# Altium schematic sheet pca10143_sheet2_nrf5340_mcu.SchDoc: PCA10143 - nRF5340 MCU
size A3; Organization: Nordic Semiconductor; DocumentNumber: 2; Revision: 0.7.2; SheetNumber: 2; SheetTotal: 7; CompanyName: Nordic Semiconductor
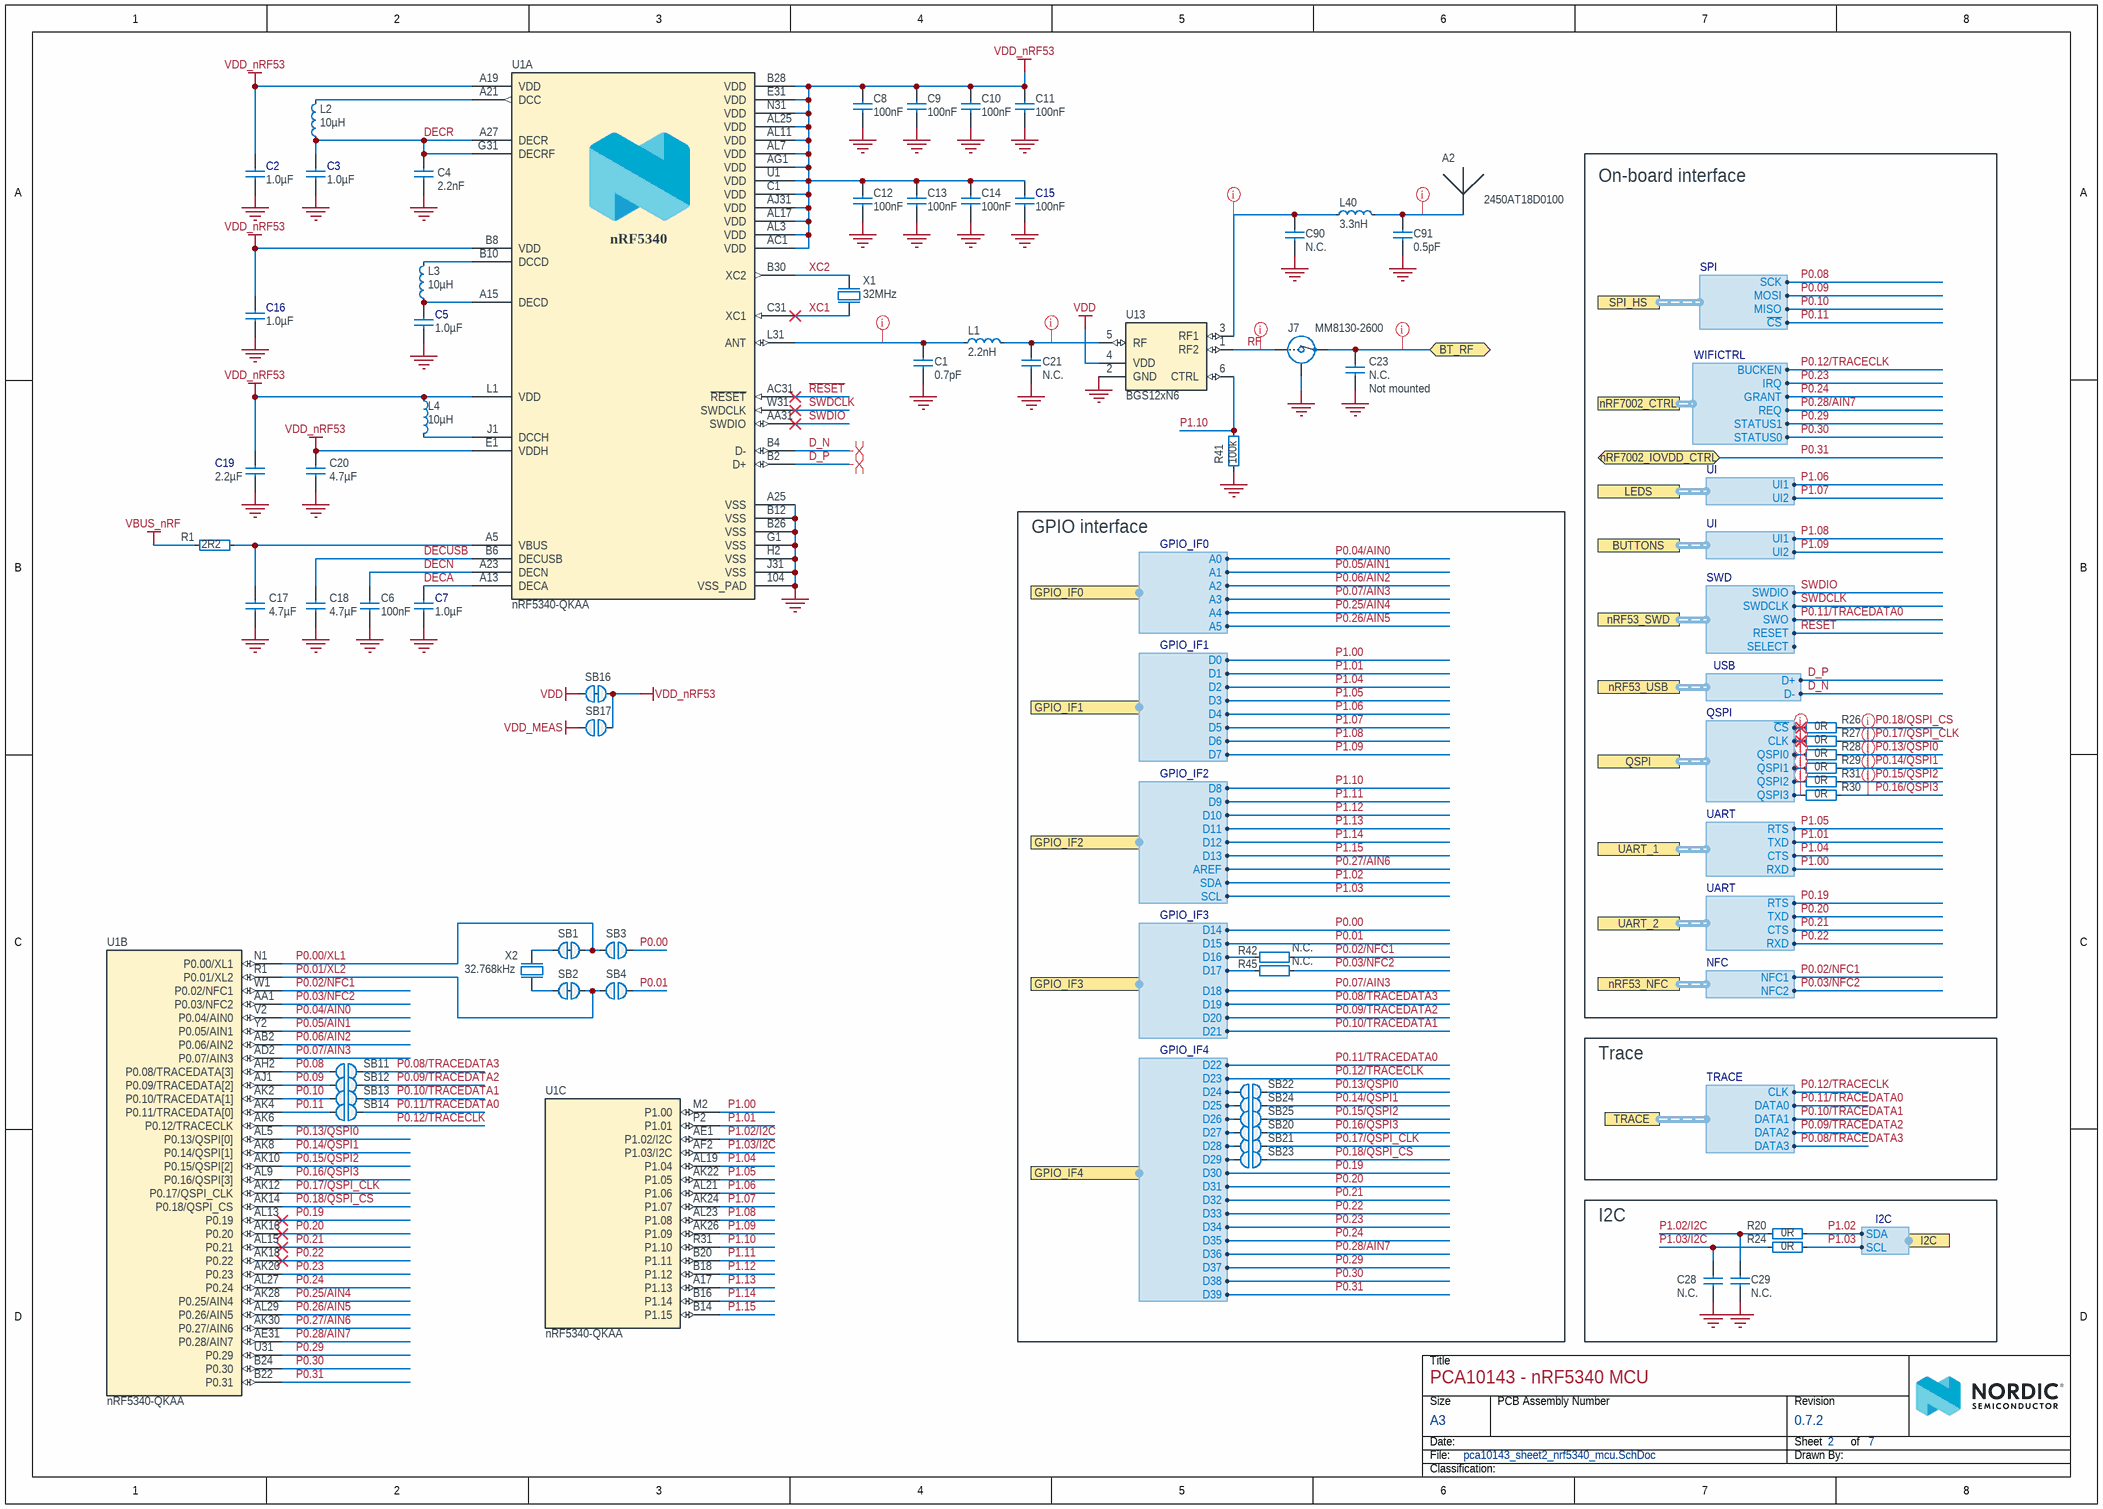
[diagram p0: pca10143_sheet2_nrf5340_mcu.SchDoc]

## Parts
A2  2450AT18D0100  [2450AT18D0100_STD-R]
C1  0.7pF  [CAPC0603X03L_C]
C2  1.0µF  [CAPC1005X04L]
C3  1.0µF  [CAPC1005X04L]
C4  2.2nF  [CAPC0603X03L_C]
C5  1.0µF  [CAPC1005X04L]
C6  100nF  [CAPC0603X03L_C]
C7  1.0µF  [CAPC1005X04L]
C8  100nF  [CAPC0603X03L_C]
C9  100nF  [CAPC0603X03L_C]
C10  100nF  [CAPC0603X03L_C]
C11  100nF  [CAPC0603X03L_C]
C12  100nF  [CAPC0603X03L_C]
C13  100nF  [CAPC0603X03L_C]
C14  100nF  [CAPC0603X03L_C]
C15  100nF  [CAPC0603X03L_C]
C16  1.0µF  [CAPC1005X04L]
C17  4.7µF  [CAPC1608X06L]
C18  4.7µF  [CAPC1608X06L]
C19  2.2µF  [CAPC1608X06L]
C20  4.7µF  [CAPC1608X06L]
C21  N.C.  [CAPC0603X03L_C_NC]
C23  N.C.  Assembly: Not mounted  [CAPC0603X03L_C_NC]
C28  N.C.  [CAPC0603X03L_C_NC]
C29  N.C.  [CAPC0603X03L_C_NC]
C90  N.C.  [CAPC0603X03L_C_NC]
C91  0.5pF  [CAPC0603X03L_C]
J7  MM8130-2600  [COAXIAL-SWF]
L1  2.2nH  [INDC0603X03L_C]
L2  10µH  [INDC1608X06L]
L3  10µH  [INDC1608X06L]
L4  10µH  [INDC1608X06L]
L40  3.3nH  [INDC0603X03L_C]
R1  2R2  [RESC0603X03L_C]
R20  0R  [RESC0603X03L_C]
R24  0R  [RESC0603X03L_C]
R26  0R  [RESC0603X03L_C]
R27  0R  [RESC0603X03L_C]
R28  0R  [RESC0603X03L_C]
R29  0R  [RESC0603X03L_C]
R30  0R  [RESC0603X03L_C]
R31  0R  [RESC0603X03L_C]
R41  100k  [RESC0603X03L_C]
R42  N.C.  [RESC0603X03L_C_NC]
R45  N.C.  [RESC0603X03L_C_NC]
SB1  Solderbridge  [Solderbridge_Shorted]  (value not drawn)  (net tie, no BOM)
SB2  Solderbridge  [Solderbridge_Shorted]  (value not drawn)  (net tie, no BOM)
SB3  Solderbridge  [Solderbridge]  (value not drawn)  (no BOM)
SB4  Solderbridge  [Solderbridge]  (value not drawn)  (no BOM)
SB11  Solderbridge  [Solderbridge]  (value not drawn)  (no BOM)
SB12  Solderbridge  [Solderbridge]  (value not drawn)  (no BOM)
SB13  Solderbridge  [Solderbridge]  (value not drawn)  (no BOM)
SB14  Solderbridge  [Solderbridge]  (value not drawn)  (no BOM)
SB16  Solderbridge  [Solderbridge_Shorted]  (value not drawn)  (net tie, no BOM)
SB17  Solderbridge  [Solderbridge]  (value not drawn)  (no BOM)
SB20  Solderbridge  [Solderbridge]  (value not drawn)  (no BOM)
SB21  Solderbridge  [Solderbridge]  (value not drawn)  (no BOM)
SB22  Solderbridge  [Solderbridge]  (value not drawn)  (no BOM)
SB23  Solderbridge  [Solderbridge]  (value not drawn)  (no BOM)
SB24  Solderbridge  [Solderbridge]  (value not drawn)  (no BOM)
SB25  Solderbridge  [Solderbridge]  (value not drawn)  (no BOM)
U1  nRF5340-QKAA  [AQFN40P700X700X85_HS-99N]  (parts A,B,C of 3)
U13  BGS12xN6  [TSNP-6-8]
X1  32MHz  [BT-XTAL_2016]
X2  32.768kHz  [XTAL_2012]

## Blocks framed on the sheet
On-board interface: R26-R31
GPIO interface: R42 R45 SB20-SB25
I2C: C28 C29 R20 R24

## Ports
BT_RF (bidir), BUTTONS (harness UI), GPIO_IF0 (harness GPIO_IF0), GPIO_IF1 (harness GPIO_IF1), GPIO_IF2 (harness GPIO_IF2), GPIO_IF3 (harness GPIO_IF3), GPIO_IF4 (harness GPIO_IF4), I2C (harness I2C), LEDS (harness UI), nRF53_NFC (harness NFC), nRF53_SWD (harness SWD), nRF53_USB (harness USB), nRF7002_CTRL (harness WIFICTRL), nRF7002_IOVDD_CTRL (bidir), QSPI (harness QSPI), SPI_HS (harness SPI), TRACE (harness TRACE), UART_1 (harness UART), UART_2 (harness UART)

## Harnesses
QSPI: ~{CS}, QSPI0, CLK, QSPI1, QSPI2, QSPI3
SWD: SWDIO, SWDCLK, SWO, RESET, SELECT
UI: UI2, UI1
USB: D+, D-
TRACE: CLK, DATA0, DATA1, DATA3, DATA2
NFC: NFC2, NFC1
UART: RTS, CTS, RXD, TXD
GPIO_IF1: D0, D1, D2, D3, D4, D5, D6, D7
GPIO_IF2: D8, D9, D10, D11, D12, D13, AREF, SDA, SCL
GPIO_IF0: A0, A1, A2, A3, A4, A5
GPIO_IF3: D14, D15, D16, D17, D18, D19, D20, D21
I2C: SCL, SDA
GPIO_IF4: D22, D23, D24, D25, D26, D27, D28, D29, D30, D31, D32, D33, D34, D35, D36, D37, D38, D39
WIFICTRL: BUCKEN, GRANT, IRQ, REQ, STATUS0, STATUS1
SPI: ~{CS}, MOSI, MISO, SCK

## Nets
GND: A2.2(GND) C1.1 C2.2 C3.1 C4.2 C5.1 C6.2 C7.1 C8.2 C9.2 C10.2 C11.2 C12.2 C13.2 C14.2 C15.2 C16.1 C17.2 C18.2 C19.2 C20.2 C21.1 C23.2 C28.1 C29.1 C90.1 C91.1 J7.2(Shield) R41.2 U1.104(VSS_PAD) U1.A25(VSS) U1.B12(VSS) U1.B26(VSS) U1.G1(VSS) U1.H2(VSS) U1.J31(VSS) U13.2(GND) X1.2(GND) X1.4(GND)
VBUS_nRF: R1.1
VDD: SB16.1 U13.4(VDD)
VDD_MEAS: SB17.1
VDD_nRF53: C2.1 C8.1 C9.1 C10.1 C11.1 C12.1 C13.1 C14.1 C15.1 C16.2 C19.1 C20.1 L4.1 SB16.2 SB17.2 U1.A19(VDD) U1.AC1(VDD) U1.AG1(VDD) U1.AJ31(VDD) U1.AL3(VDD) U1.AL7(VDD) U1.AL11(VDD) U1.AL17(VDD) U1.AL25(VDD) U1.B8(VDD) U1.B28(VDD) U1.C1(VDD) U1.E1(VDDH) U1.E31(VDD) U1.L1(VDD) U1.N31(VDD) U1.U1(VDD)
BT_RF: C23.1 J7.3(OUT) ; port BT_RF
D_N: U1.B4(D-) ; port nRF53_USB.D-
D_P: U1.B2(D+) ; port nRF53_USB.D+
DECA: C7.2 U1.A13(DECA)
DECN: C6.1 U1.A23(DECN)
DECR: C3.2 C4.1 L2.1 U1.A27(DECR) U1.G31(DECRF)
DECUSB: C18.1 U1.B6(DECUSB)
P0.00: SB3.2 ; port GPIO_IF3.D14
P0.00/XL1: SB1.2 SB3.1 U1.N1(P0.00/XL1)
P0.01: SB4.2 ; port GPIO_IF3.D15
P0.01/XL2: SB2.2 SB4.1 U1.R1(P0.01/XL2)
P0.02/NFC1: R42.2 U1.W1(P0.02/NFC1) ; port nRF53_NFC.NFC1
P0.03/NFC2: R45.2 U1.AA1(P0.03/NFC2) ; port nRF53_NFC.NFC2
P0.04/AIN0: U1.V2(P0.04/AIN0) ; port GPIO_IF0.A0
P0.05/AIN1: U1.Y2(P0.05/AIN1) ; port GPIO_IF0.A1
P0.06/AIN2: U1.AB2(P0.06/AIN2) ; port GPIO_IF0.A2
P0.07/AIN3: U1.AD2(P0.07/AIN3) ; port GPIO_IF0.A3, port GPIO_IF3.D18
P0.08: SB11.2 U1.AH2(P0.08/TRACEDATA[3]) ; port SPI_HS.SCK
P0.08/TRACEDATA3: SB11.1 ; port TRACE.DATA3, port GPIO_IF3.D19
P0.09: SB12.2 U1.AJ1(P0.09/TRACEDATA[2]) ; port SPI_HS.MOSI
P0.09/TRACEDATA2: SB12.1 ; port TRACE.DATA2, port GPIO_IF3.D20
P0.10: SB13.2 U1.AK2(P0.10/TRACEDATA[1]) ; port SPI_HS.MISO
P0.10/TRACEDATA1: SB13.1 ; port TRACE.DATA1, port GPIO_IF3.D21
P0.11: SB14.2 U1.AK4(P0.11/TRACEDATA[0]) ; port SPI_HS.~{CS}
P0.11/TRACEDATA0: SB14.1 ; port nRF53_SWD.SWO, port TRACE.DATA0, port GPIO_IF4.D22
P0.12/TRACECLK: U1.AK6(P0.12/TRACECLK) ; port TRACE.CLK, port GPIO_IF4.D23, port nRF7002_CTRL.BUCKEN
P0.13/QSPI0: R28.1 SB22.1 U1.AL5(P0.13/QSPI[0])
P0.14/QSPI1: R29.1 SB24.1 U1.AK8(P0.14/QSPI[1])
P0.15/QSPI2: R31.1 SB25.1 U1.AK10(P0.15/QSPI[2])
P0.16/QSPI3: R30.1 SB20.1 U1.AL9(P0.16/QSPI[3])
P0.17/QSPI_CLK: R27.1 SB21.1 U1.AK12(P0.17/QSPI_CLK)
P0.18/QSPI_CS: R26.1 SB23.1 U1.AK14(P0.18/QSPI_CS)
P0.19: U1.AL13(P0.19) ; port UART_2.RTS, port GPIO_IF4.D30
P0.20: U1.AK16(P0.20) ; port UART_2.TXD, port GPIO_IF4.D31
P0.21: U1.AL15(P0.21) ; port UART_2.CTS, port GPIO_IF4.D32
P0.22: U1.AK18(P0.22) ; port UART_2.RXD, port GPIO_IF4.D33
P0.23: U1.AK20(P0.23) ; port GPIO_IF4.D34, port nRF7002_CTRL.IRQ
P0.24: U1.AL27(P0.24) ; port GPIO_IF4.D35, port nRF7002_CTRL.GRANT
P0.25/AIN4: U1.AK28(P0.25/AIN4) ; port GPIO_IF0.A4
P0.26/AIN5: U1.AL29(P0.26/AIN5) ; port GPIO_IF0.A5
P0.27/AIN6: U1.AK30(P0.27/AIN6) ; port GPIO_IF2.AREF
P0.28/AIN7: U1.AE31(P0.28/AIN7) ; port GPIO_IF4.D36, port nRF7002_CTRL.REQ
P0.29: U1.U31(P0.29) ; port GPIO_IF4.D37, port nRF7002_CTRL.STATUS1
P0.30: U1.B24(P0.30) ; port GPIO_IF4.D38, port nRF7002_CTRL.STATUS0
P0.31: U1.B22(P0.31) ; port nRF7002_IOVDD_CTRL, port GPIO_IF4.D39
P1.00: U1.M2(P1.00) ; port GPIO_IF1.D0, port UART_1.RXD
P1.01: U1.P2(P1.01) ; port GPIO_IF1.D1, port UART_1.TXD
P1.02: R20.1 ; port GPIO_IF2.SDA, port I2C.SDA
P1.02/I2C: C29.2 R20.2 U1.AE1(P1.02/I2C)
P1.03: R24.1 ; port GPIO_IF2.SCL, port I2C.SCL
P1.03/I2C: C28.2 R24.2 U1.AF2(P1.03/I2C)
P1.04: U1.AL19(P1.04) ; port GPIO_IF1.D2, port UART_1.CTS
P1.05: U1.AK22(P1.05) ; port GPIO_IF1.D3, port UART_1.RTS
P1.06: U1.AL21(P1.06) ; port LEDS.UI1, port GPIO_IF1.D4
P1.07: U1.AK24(P1.07) ; port LEDS.UI2, port GPIO_IF1.D5
P1.08: U1.AL23(P1.08) ; port BUTTONS.UI1, port GPIO_IF1.D6
P1.09: U1.AK26(P1.09) ; port BUTTONS.UI2, port GPIO_IF1.D7
P1.10: R41.1 U1.R31(P1.10) U13.6(CTRL) ; port GPIO_IF2.D8
P1.11: U1.B20(P1.11) ; port GPIO_IF2.D9
P1.12: U1.B18(P1.12) ; port GPIO_IF2.D10
P1.13: U1.A17(P1.13) ; port GPIO_IF2.D11
P1.14: U1.B16(P1.14) ; port GPIO_IF2.D12
P1.15: U1.B14(P1.15) ; port GPIO_IF2.D13
~{RESET}: U1.AC31(~{RESET}) ; port nRF53_SWD.RESET
RF: J7.1(IN) U13.1(RF2)
SWDCLK: U1.W31(SWDCLK) ; port nRF53_SWD.SWDCLK
SWDIO: U1.AA31(SWDIO) ; port nRF53_SWD.SWDIO
XC1: U1.C31(XC1) X1.1(inp)
XC2: U1.B30(XC2) X1.3(out)
NetA2_1: A2.1 C91.2 L40.1
NetC1_2: C1.2 L1.1 U1.L31(ANT)
NetC5_2: C5.2 L3.1 U1.A15(DECD)
NetC17_1: C17.1 R1.2 U1.A5(VBUS)
NetC21_2: C21.2 L1.2 U13.5(RF)
NetC90_2: C90.2 L40.2 U13.3(RF1)
NetL2_2: L2.2 U1.A21(DCC)
NetL3_2: L3.2 U1.B10(DCCD)
NetL4_2: L4.2 U1.J1(DCCH)
NetR26_2: R26.2 ; port QSPI.~{CS}
NetR27_2: R27.2 ; port QSPI.CLK
NetR28_2: R28.2 ; port QSPI.QSPI0
NetR29_2: R29.2 ; port QSPI.QSPI1
NetR30_2: R30.2 ; port QSPI.QSPI3
NetR31_2: R31.2 ; port QSPI.QSPI2
NetR42_1: R42.1 ; port GPIO_IF3.D16
NetR45_1: R45.1 ; port GPIO_IF3.D17
NetSB1_1: SB1.1 X2.1(inp)
NetSB2_1: SB2.1 X2.2(out)
NetSB20_2: SB20.2 ; port GPIO_IF4.D27
NetSB21_2: SB21.2 ; port GPIO_IF4.D28
NetSB22_2: SB22.2 ; port GPIO_IF4.D24
NetSB23_2: SB23.2 ; port GPIO_IF4.D29
NetSB24_2: SB24.2 ; port GPIO_IF4.D25
NetSB25_2: SB25.2 ; port GPIO_IF4.D26

Not connected (* = marked no-connect by the designer): U1 AG31(N.C.) D2(N.C.) F2(N.C.) T2(N.C.); U13 8(NC)

## Layout directives
differential pair: D_N, D_P
net class QSPI_Data: P0.13/QSPI0, P0.14/QSPI1, P0.15/QSPI2, P0.16/QSPI3, P0.17/QSPI_CLK
net class QSPI_Data2: NetR27_2, NetR28_2, NetR29_2, NetR30_2, NetR31_2
net class RF50Ohm: BT_RF, NetA2_1, NetC1_2, NetC21_2, NetC90_2, RF

## Notes on the sheet
- Trace
- Title
- Size
- Date:
- File:
- A3
- PCB Assembly Number
- Sheet         of
- Drawn By:
- Revision
- Classification:
- (in symbol nRF5340-QKAAD0, part A) nRF5340

## Library data of the parts
A2 = Johanson 2450AT18D0100_STD-R: 2.45 GHz chip antenna; Manufacturer: Johanson Technology; Part number IPS: 00000001415; Part number NEMS: 100700005; Pad Count: 4; Note: N.A.; Artikkelnr Noca: 53059035; Component Status: Active; Part Number: Johanson 2450AT18D0100_STD-R; PartId: 100700005; Component Class: Antennas; Author: rsk; Manufacturer Part Number: 2450AT18D0100; ComponentLink1URL: N.A.; ComponentLink1Description: Datasheet; ComponentLink2URL: N.A.; ComponentLink2Description: Supplier link; HelpURL: http://www.johansontechnology.com/datasheets/antennas/2450AT18D0100.pdf; Footprint Doc: 2450AT18D0100; LatestRevisionDate: 2016-06-02; Published: 2016-01-12; Value: 2450AT18D0100; Supplier 1: Digi-Key; Supplier Part Number 1: 2450AT18D0100E; Supplier 2: Mouser; Supplier Part Number 2: 609-2450AT18D0100E; Part number Norautron: N.A.
C1 = C0201-0.7p-HQ-Murata: Capacitor, Ceramic, NP0, ±0.1pF, 25V; Manufacturer: Murata; Manufacturer Part Number: GJM0335C1ER70BB01D; Part number Norautron: 26470001; Part number NEMS: 100200441; Artikkelnr Noca: N.A.; Pad Count: 2; Component Status: Active; Part Number: C0201-0.7p-HQ-Murata; LatestRevisionDate: 2020-10-13; Published: 2020-03-05; Value: 0.7pF; Note: 25V; Footprint Doc: 0201; ComponentLink1URL: https://search.murata.co.jp/Ceramy/image/img/A01X/G101/ENG/GJM0335C1ER70BB01-01.pdf; ComponentLink1Description: Datasheet; ComponentLink2URL: https://www.murata.com/en-eu/products/productdetail?partno=GJM0335C1ER70BB01%23; ComponentLink2Description: Supplier link; HelpURL: https://www.digikey.no/product-detail/en/murata-electronics/GJM0335C1ER70BB01D/490-8076-1-ND/4380362; Supplier 1: Digi-Key; Supplier Part Number 1: 490-8076-1-ND; Supplier 2: N.A.; Supplier Part Number 2: N.A.; Part number IPS: N.A.; Component Class: Capacitors; PartId: 100200441; Author: rsk
C2 C3 C5 C7 C16 = C0402-1µ0-6.3V-X5R-5%: Capacitor, X5R, ±5%, 6.3V; Manufacturer: N.A.; Part number IPS: 00000007786, 00000003457; Part number NEMS: 100200190; Artikkelnr Noca: 20039235; Pad Count: 2; Component Status: Active; Part Number: C0402-1µ0-6.3V-X5R-5%; Manufacturer Part Number: N.A.; LatestRevisionDate: 2021-07-22; Published: 2009-05-08; Value: 1.0µF; Note: 6.3V; Footprint Doc: 0402; ComponentLink1URL: N.A.; ComponentLink1Description: Datasheet; ComponentLink2URL: N.A.; ComponentLink2Description: Supplier link; HelpURL: N.A.; Supplier 1: Digi-Key; Supplier Part Number 1: 1276-1444-1-ND; Supplier 2: N.A.; Supplier Part Number 2: N.A.; Component Class: Capacitors; PartId: 100200190; Author: rsk; Part number Norautron: N.A.
C4 = C0201-2n2: Capacitor, X7R, ±10%, 10V; Manufacturer: N.A.; Part number IPS: 00000001778; Part number Norautron: 26470002; Part number NEMS: 100200060; Pad Count: 2; Component Status: Active; Part Number: C0201-2n2; LatestRevisionDate: 2014-11-13; Published: 2014-11-13; Value: 2.2nF; Footprint Doc: 0201; Manufacturer Part Number: N.A.; ComponentLink1URL: N.A.; ComponentLink1Description: Datasheet; ComponentLink2URL: N.A.; ComponentLink2Description: Supplier link; HelpURL: N.A.; Note: 10V; Supplier 1: N.A.; Supplier Part Number 1: N.A.; Supplier 2: N.A.; Supplier Part Number 2: N.A.; Artikkelnr Noca: N.A.; Component Class: Capacitors; PartId: 100200060; Author: rsk
C6 C8-C15 = C0201-100n: Capacitor, X5R, ±10%; Manufacturer: N.A.; Part number IPS: 00000001248, 00000002505; Part number Norautron: 262071862; Part number NEMS: 100200078; Note: 16V; Pad Count: 2; Component Status: Active; Part Number: C0201-100n; Manufacturer Part Number: N.A.; LatestRevisionDate: 2017-11-09; Published: 2014-11-13; Value: 100nF; Artikkelnr Noca: N.A.; Footprint Doc: 0201; ComponentLink1URL: N.A.; ComponentLink1Description: Datasheet; ComponentLink2URL: N.A.; ComponentLink2Description: Supplier link; HelpURL: N.A.; Supplier 1: N.A.; Supplier Part Number 1: N.A.; Supplier 2: N.A.; Supplier Part Number 2: N.A.; Component Class: Capacitors; PartId: 100200078; Author: rsk
C17 C18 C20 = C0603-4µ7-10V-X7S: Capacitor, X7S, ±10%, 10V; Manufacturer: N.A.; Part number IPS: 00000001779; Part number NEMS: 100200351; Artikkelnr Noca: 20030013; Pad Count: 2; Component Status: Active; Part Number: C0603-4µ7-10V-X7S; LatestRevisionDate: 2016-08-15; Published: 2016-08-15; Value: 4.7µF; Note: 10V; Footprint Doc: 0603; Manufacturer Part Number: N.A.; ComponentLink1URL: N.A.; ComponentLink1Description: Datasheet; ComponentLink2URL: N.A.; ComponentLink2Description: Supplier link; HelpURL: N.A.; Supplier 1: Digi-Key; Supplier Part Number 1: 445-14258-1-ND; Supplier 2: N.A.; Supplier Part Number 2: N.A.; Component Class: Capacitors; PartId: 100200351; Author: rsk; Part number Norautron: N.A.
C19 = C0603-2µ2-6.3V-X7R: Capacitor, X7R, ±10%; Manufacturer: N.A.; Part number NEMS: 100200272; Note: 6.3V; Artikkelnr Noca: 20039322; Pad Count: 2; Component Status: Active; Part Number: C0603-2µ2-6.3V-X7R; Manufacturer Part Number: N.A.; LatestRevisionDate: 2021-07-22; Published: 2009-05-08; Value: 2.2µF; Footprint Doc: 0603; ComponentLink1URL: N.A.; ComponentLink1Description: Datasheet; ComponentLink2URL: N.A.; ComponentLink2Description: Supplier link; HelpURL: N.A.; Supplier 1: N.A.; Supplier Part Number 1: N.A.; Supplier 2: N.A.; Supplier Part Number 2: N.A.; Part number IPS: N.A.; Component Class: Capacitors; PartId: 100200272; Author: rsk; Part number Norautron: N.A.
C21 C90 = C0201-N.C.: Not mounted; Manufacturer: N.A.; Part number NEMS: 100200001; Note: Chip Cap; Assembly: Not mounted; Pad Count: 2; Component Status: Active; Part Number: C0201-N.C.; LatestRevisionDate: 2014-11-13; Published: 2014-11-13; Value: N.C.; Footprint Doc: 0201; Manufacturer Part Number: N.A.; Artikkelnr Noca: N.A.; Part number IPS: N.A.; ComponentLink1URL: N.A.; ComponentLink1Description: Datasheet; ComponentLink2URL: N.A.; ComponentLink2Description: Supplier link; HelpURL: N.A.; Supplier 1: N.A.; Supplier Part Number 1: N.A.; Supplier 2: N.A.; Supplier Part Number 2: N.A.; Component Class: Capacitors; PartId: 100200001; Author: rsk; Part number Norautron: N.A.
C23 = C0201-N.C.: Not mounted; Manufacturer: N.A.; Part number NEMS: 100200001; Note: Chip Cap; Pad Count: 2; Component Status: Active; Part Number: C0201-N.C.; Manufacturer Part Number: N.A.; LatestRevisionDate: 2014-11-13; Published: 2014-11-13; Value: N.C.; Artikkelnr Noca: N.A.; Footprint Doc: 0201; Part number IPS: N.A.; ComponentLink1URL: N.A.; ComponentLink1Description: Datasheet; ComponentLink2URL: N.A.; ComponentLink2Description: Supplier link; HelpURL: N.A.; Supplier 1: N.A.; Supplier Part Number 1: N.A.; Supplier 2: N.A.; Supplier Part Number 2: N.A.; Component Class: Capacitors; PartId: 100200001; Author: rsk; Part number Norautron: N.A.
C28 C29 = C0201-N.C.: Not mounted; Manufacturer: N.A.; Part number NEMS: 100200001; Assembly: Not mounted; Note: Chip Cap; Pad Count: 2; Component Status: Active; Part Number: C0201-N.C.; Manufacturer Part Number: N.A.; Footprint Doc: 0201; LatestRevisionDate: 2014-11-13; Published: 2014-11-13; Value: N.C.; Artikkelnr Noca: N.A.; Part number IPS: N.A.; ComponentLink1URL: N.A.; ComponentLink1Description: Datasheet; ComponentLink2URL: N.A.; ComponentLink2Description: Supplier link; HelpURL: N.A.; Supplier 1: N.A.; Supplier Part Number 1: N.A.; Supplier 2: N.A.; Supplier Part Number 2: N.A.; Component Class: Capacitors; PartId: 100200001; Author: rsk; Part number Norautron: N.A.
C91 = C0201-0.5p: Capacitor, NP0, ±0.05pF; Manufacturer: N.A.; Part number NEMS: 100200008; Note: 50V; Pad Count: 2; Component Status: Active; Part Number: C0201-0.5p; LatestRevisionDate: 2018-10-22; Published: 2014-11-13; Value: 0.5pF; Footprint Doc: 0201; Manufacturer Part Number: N.A.; Artikkelnr Noca: N.A.; Part number IPS: N.A.; ComponentLink1URL: N.A.; ComponentLink1Description: Datasheet; ComponentLink2URL: N.A.; ComponentLink2Description: Supplier link; HelpURL: N.A.; Supplier 1: N.A.; Supplier Part Number 1: N.A.; Supplier 2: N.A.; Supplier Part Number 2: N.A.; Component Class: Capacitors; PartId: 100200008; Author: rsk; Part number Norautron: N.A.
J7 = MM8130-2600: Coaxial Connector with Switch; Manufacturer: Murata; Part number IPS: 00000009955; Part number Norautron: 26030338; Part number NEMS: 100500400; Note: N.A.; Artikkelnr Noca: 55029011; Pad Count: 3; Component Status: Active; Part Number: MM8130-2600; Manufacturer Part Number: MM8130-2600; LatestRevisionDate: 2014-04-24; Published: 2014-04-24; Value: MM8130-2600; Footprint Doc: COAXIAL-SWF; ComponentLink1URL: N.A.; ComponentLink1Description: Datasheet; ComponentLink2URL: N.A.; ComponentLink2Description: Supplier link; HelpURL: http://www.murata.com/products/catalog/pdf/o33e.pdf; Supplier 1: Digi-Key; Supplier Part Number 1: 490-4981-1-ND; Supplier 2: Mouser; Supplier Part Number 2: 81-MM8130-2600RA2; Component Class: Connectors; PartId: 100500400; Author: rsk
L1 = L0201-2n2-HQ-Murata: Inductor, 600mA, ±0.1ｎH, 120mOhm; Manufacturer: Murata; Manufacturer Part Number: LQP03HQ2N2B02; Part number Norautron: 26521773; Part number NEMS: 100300209; Note: -55°C ~ 125°C; Artikkelnr Noca: N.A.; Pad Count: 2; Component Status: Active; Part Number: L0201-2n2-HQ-Murata; ComponentLink1URL: https://search.murata.co.jp/Ceramy/image/img/P02/JELF243C-0021.pdf; ComponentLink1Description: Datasheet; ComponentLink2URL: N.A.; ComponentLink2Description: Supplier link; HelpURL: https://psearch.en.murata.com/inductor/product/LQP03HQ2N2B02%23.html; Footprint Doc: 0201; LatestRevisionDate: 2018-10-23; Published: 2018-10-23; Value: 2.2nH; Supplier 1: Digi-Key; Supplier Part Number 1: 490-13899-1-ND; Supplier 2: N.A.; Supplier Part Number 2: N.A.; Part number IPS: N.A.; Component Class: Inductors; PartId: 100300209; Author: rsk
L2-L4 = L0603-10µ-TDK: Inductor, 250mA, ±20%, 1.05ohm. -55°C ~ 125°C; Manufacturer: TDK Corporation; Manufacturer Part Number: MLZ1608M100WTD25; Part number Norautron: 26521771; Part number NEMS: 100300079; Note: N.A.; Pad Count: 2; Component Status: Active; Part Number: L0603-10µ-TDK; LatestRevisionDate: 2012-09-19; Published: 2019-05-06; Value: 10µH; Artikkelnr Noca: N.A.; Footprint Doc: 0603; ComponentLink1URL: N.A.; ComponentLink1Description: Datasheet; ComponentLink2URL: N.A.; ComponentLink2Description: Supplier link; HelpURL: https://product.tdk.com/info/en/catalog/datasheets/inductor_automotive_decoupling_mlz1608_en.pdf; Supplier 1: Digi-Key; Supplier Part Number 1: 445-175588-1-ND; Supplier 2: Mouser; Supplier Part Number 2: 810-MLZ1608M100WTD25; Part number IPS: N.A.; Component Class: Inductors; PartId: 100300079; Author: rsk
L40 = L0201-3n3-HQ-Murata: Inductor, 500mA, ±0.1ｎH, 170mOhm; Manufacturer: Murata; Manufacturer Part Number: LQP03HQ3N3B02; Part number NEMS: 100300220; Note: -55°C ~ 125°C; Artikkelnr Noca: N.A.; Pad Count: 2; Component Status: Active; Part Number: L0201-3n3-HQ-Murata; ComponentLink1URL: https://search.murata.co.jp/Ceramy/image/img/P02/JELF243C-0021.pdf; ComponentLink1Description: Datasheet; ComponentLink2URL: N.A.; ComponentLink2Description: Supplier link; HelpURL: https://psearch.en.murata.com/inductor/product/LQP03HQ3N3B02%23.html; Footprint Doc: 0201; LatestRevisionDate: 2018-10-23; Published: 2018-10-23; Value: 3.3nH; Supplier 1: Digi-Key; Supplier Part Number 1: 490-13921-1-ND; Supplier 2: N.A.; Supplier Part Number 2: N.A.; Part number IPS: N.A.; Component Class: Inductors; PartId: 100300220; Author: rsk; Part number Norautron: N.A.
R1 = R0201-2R2: Resistor, ±1%, 0.05W; Manufacturer: N.A.; Part number Norautron: 26470029; Part number NEMS: 100100006; Note: Chip Res 1%; Pad Count: 2; Component Status: Active; Part Number: R0201-2R2; Manufacturer Part Number: N.A.; ComponentLink1URL: N.A.; ComponentLink1Description: Datasheet; ComponentLink2URL: N.A.; ComponentLink2Description: Supplier link; HelpURL: N.A.; Footprint Doc: 0201; LatestRevisionDate: 2014-11-13; Published: 2014-11-13; Value: 2R2; Supplier 1: N.A.; Supplier Part Number 1: N.A.; Supplier 2: N.A.; Supplier Part Number 2: N.A.; Artikkelnr Noca: N.A.; Part number IPS: N.A.; Component Class: Resistors; PartId: 100100006; Author: rsk
R20 R24 R26-R31 = R0201-0R: Resistor, ±5%, 0.05W; Manufacturer: N.A.; Part number IPS: 00000003245; Part number NEMS: 100100001; Note: Chip Res 5%; Pad Count: 2; Component Status: Active; Part Number: R0201-0R; Manufacturer Part Number: N.A.; Footprint Doc: 0201; LatestRevisionDate: 2017-11-09; Published: 2014-11-13; Value: 0R; Artikkelnr Noca: N.A.; ComponentLink1URL: N.A.; ComponentLink1Description: Datasheet; ComponentLink2URL: N.A.; ComponentLink2Description: Supplier link; HelpURL: N.A.; Supplier 1: N.A.; Supplier Part Number 1: N.A.; Supplier 2: N.A.; Supplier Part Number 2: N.A.; Component Class: Resistors; PartId: 100100001; Author: rsk; Part number Norautron: N.A.
R41 = R0201-100k: Resistor, ±1%, 0.05W; Manufacturer: N.A.; Part number IPS: 00000001419; Part number Norautron: 26108487; Part number NEMS: 100100080; Note: Chip Res 1%; Pad Count: 2; Component Status: Active; Part Number: R0201-100k; Manufacturer Part Number: N.A.; Footprint Doc: 0201; LatestRevisionDate: 2014-11-13; Published: 2014-11-13; Value: 100k; Artikkelnr Noca: N.A.; ComponentLink1URL: N.A.; ComponentLink1Description: Datasheet; ComponentLink2URL: N.A.; ComponentLink2Description: Supplier link; HelpURL: N.A.; Supplier 1: N.A.; Supplier Part Number 1: N.A.; Supplier 2: N.A.; Supplier Part Number 2: N.A.; Component Class: Resistors; PartId: 100100080; Author: rsk
R42 R45 = R0201-N.C.: Not mounted; Manufacturer: N.A.; Part number NEMS: 100100107; Note: Chip Res; Assembly: Not mounted; Pad Count: 2; Component Status: Active; Part Number: R0201-N.C.; Manufacturer Part Number: N.A.; Footprint Doc: 0201; LatestRevisionDate: 2014-11-13; Published: 2014-11-13; Value: N.C.; Artikkelnr Noca: N.A.; Part number IPS: N.A.; ComponentLink1URL: N.A.; ComponentLink1Description: Datasheet; ComponentLink2URL: N.A.; ComponentLink2Description: Supplier link; HelpURL: N.A.; Supplier 1: N.A.; Supplier Part Number 1: N.A.; Supplier 2: N.A.; Supplier Part Number 2: N.A.; Component Class: Resistors; PartId: 100100107; Author: rsk; Part number Norautron: N.A.
SB1 SB2 SB16 = Solderbridge Shorted: Shorted Solderbridge; Manufacturer: N.A.; Part number NEMS: 100500459; Pad Count: 2; Component Status: Active; Part Number: Solderbridge Shorted; Manufacturer Part Number: N.A.; LatestRevisionDate: 2012-08-07; Published: 2012-08-07; Value: Solderbridge; Note: N.A.; Artikkelnr Noca: N.A.; Footprint Doc: Solderbridge_Shorted; Part number IPS: N.A.; ComponentLink1URL: N.A.; ComponentLink1Description: Datasheet; ComponentLink2URL: N.A.; ComponentLink2Description: Supplier link; HelpURL: N.A.; Supplier 1: N.A.; Supplier Part Number 1: N.A.; Supplier 2: N.A.; Supplier Part Number 2: N.A.; Component Class: Connectors; PartId: 100500459; Author: rsk; Part number Norautron: N.A.
SB3 SB4 SB11-SB14 SB17 SB20-SB25 = Solderbridge: Manufacturer: N.A.; Part number NEMS: 100500458; Pad Count: 2; Component Status: Active; Part Number: Solderbridge; Manufacturer Part Number: N.A.; LatestRevisionDate: 2009-12-14; Published: 2009-12-14; Value: Solderbridge; Note: N.A.; Artikkelnr Noca: N.A.; Footprint Doc: Solderbridge; Part number IPS: N.A.; ComponentLink1URL: N.A.; ComponentLink1Description: Datasheet; ComponentLink2URL: N.A.; ComponentLink2Description: Supplier link; HelpURL: N.A.; Supplier 1: N.A.; Supplier Part Number 1: N.A.; Supplier 2: N.A.; Supplier Part Number 2: N.A.; Component Class: Connectors; PartId: 100500458; Author: rsk; Part number Norautron: N.A.
U1 = nRF5340-QKAAD0: Multi-protocol Bluetooth Low Energy, IEEE 802.15.4, ANT and 2.4GHz proprietary system-on-chip; Manufacturer: Nordic Semiconductor; Part number Norautron: NOD26470035; Part number NEMS: 102000216; Note: N.A.; Pad Count: 98; Component Status: Active; Nordic Delivers: X; Part Number: nRF5340-QKAAD0; Manufacturer Part Number: nRF5340-QKAAD0; Footprint Doc: AQFN-98; LatestRevisionDate: 2020-12-02; Published: 2020-12-02; Value: nRF5340-QKAA; Artikkelnr Noca: N.A.; Part number IPS: N.A.; ComponentLink1URL: N.A.; ComponentLink1Description: Datasheet; ComponentLink2URL: N.A.; ComponentLink2Description: Supplier link; HelpURL: N.A.; Supplier 1: Nordic Semiconductor; Supplier Part Number 1: nRF5340-QKAAD0; Supplier 2: N.A.; Supplier Part Number 2: N.A.; Component Class: nRF_Devices; PartId: 102000216; Author: rsk
U13 = BGS12SN6: Wideband SPDT RF Switch, 50MHz-6GHz. Max 30dBm, 1.8-3.5V; Manufacturer: Infineon Technologies; Manufacturer Part Number: BGS12SN6E6327XTSA1; Part number NEMS: 101900686; Pad Count: 6; Note: N.A.; Component Status: Active; Part Number: BGS12SN6; Component Class: Misc_ICs; Author: hany; ComponentLink1URL: https://no.mouser.com/datasheet/2/196/Infineon-BGS12SN6-DS-v02_03-EN-1226027.pdf; ComponentLink1Description: Datasheet; ComponentLink2URL: N.A.; ComponentLink2Description: Supplier link; HelpURL: https://no.mouser.com/datasheet/2/196/Infineon-BGS12SN6-DS-v02_03-EN-1226027.pdf; Footprint Doc: TSNP-6-8; LatestRevisionDate: 2022-02-17; Published: 2022-02-17; Value: BGS12SN6; Supplier 1: Mouser; Supplier Part Number 1: 726-BGS12SN6E6327XTS; Supplier 2: N.A.; Supplier Part Number 2: N.A.; Artikkelnr Noca: N.A.; Part number IPS: N.A.; Part number Norautron: N.A.; PartId: 101900686
X1 = XTAL_SMD2016_32MHz_8pF_Kyocera_SA: XTAL SMD 2016, 32MHz, Cl=8pF, ±30ppm, -40°C ~ 105°C; Manufacturer Part Number: CX2016SA32000D0WRQG1; Part number NEMS: 101600100; Note: XTAL SMD 32.000MHz; Artikkelnr Noca: N.A.; Pad Count: 4; Component Status: Active; Part Number: XTAL_SMD2016_32MHz_8pF_Kyocera_SA; Manufacturer: Kyocera; LatestRevisionDate: 2022-09-19; Published: 2022-09-19; Value: 32MHz; Footprint Doc: XTAL_2016; Part number IPS: N.A.; ComponentLink1URL: N.A.; ComponentLink1Description: Datasheet; ComponentLink2URL: N.A.; ComponentLink2Description: Supplier link; HelpURL: N.A.; Supplier 1: N.A.; Supplier Part Number 1: N.A.; Supplier 2: N.A.; Supplier Part Number 2: N.A.; Component Class: Oscillators; Author: hany; Part number Norautron: N.A.; PartId: 101600100
X2 = XTAL_SMD2012_32.768kHz_9pF_Golledge: XTAL SMD 2012, 32.768kHz, 9pF, ±20ppm; Manufacturer Part Number: MP07668; Part number Norautron: 26470047; Part number NEMS: 101600017; Note: XTAL SMD 32.768kHz; Artikkelnr Noca: N.A.; Pad Count: 2; Component Status: Active; Part Number: XTAL_SMD2012_32.768kHz_9pF_Golledge; Manufacturer: Golledge; LatestRevisionDate: 2016-11-02; Published: 2016-11-02; Value: 32.768kHz; Footprint Doc: XTAL_2012; Part number IPS: N.A.; ComponentLink1URL: N.A.; ComponentLink1Description: Datasheet; ComponentLink2URL: N.A.; ComponentLink2Description: Supplier link; HelpURL: \\hizz\pro\app9717\Datasheet\crystals\Golledge\mp07668.pdf; Supplier 1: Link Nordic; Supplier Part Number 1: N.A.; Supplier 2: N.A.; Supplier Part Number 2: N.A.; Component Class: Oscillators; PartId: 101600017; Author: rsk